# EasyEDA Pro project ProPrj_VEX_Competition_Switch_Duo_2025-08-30.epro

# Schematic VEX_Competition_Switch_Duo
Board Name: VEX_Competition_Switch_Duo; Create Date: 2025-08-25; Page Name: v1_SCH; Project Name: VEX_Competition_Switch_Duo; Schematic Name: VEX_Competition_Switch_Duo; Update Date: 2025-08-25; Add into BOM: yes; Company: Your Company; Convert to PCB: yes; Date: 2025-08-22; Draw By: noozabooz; REV: 1.0; Sheet: 1/1; spicePre: .
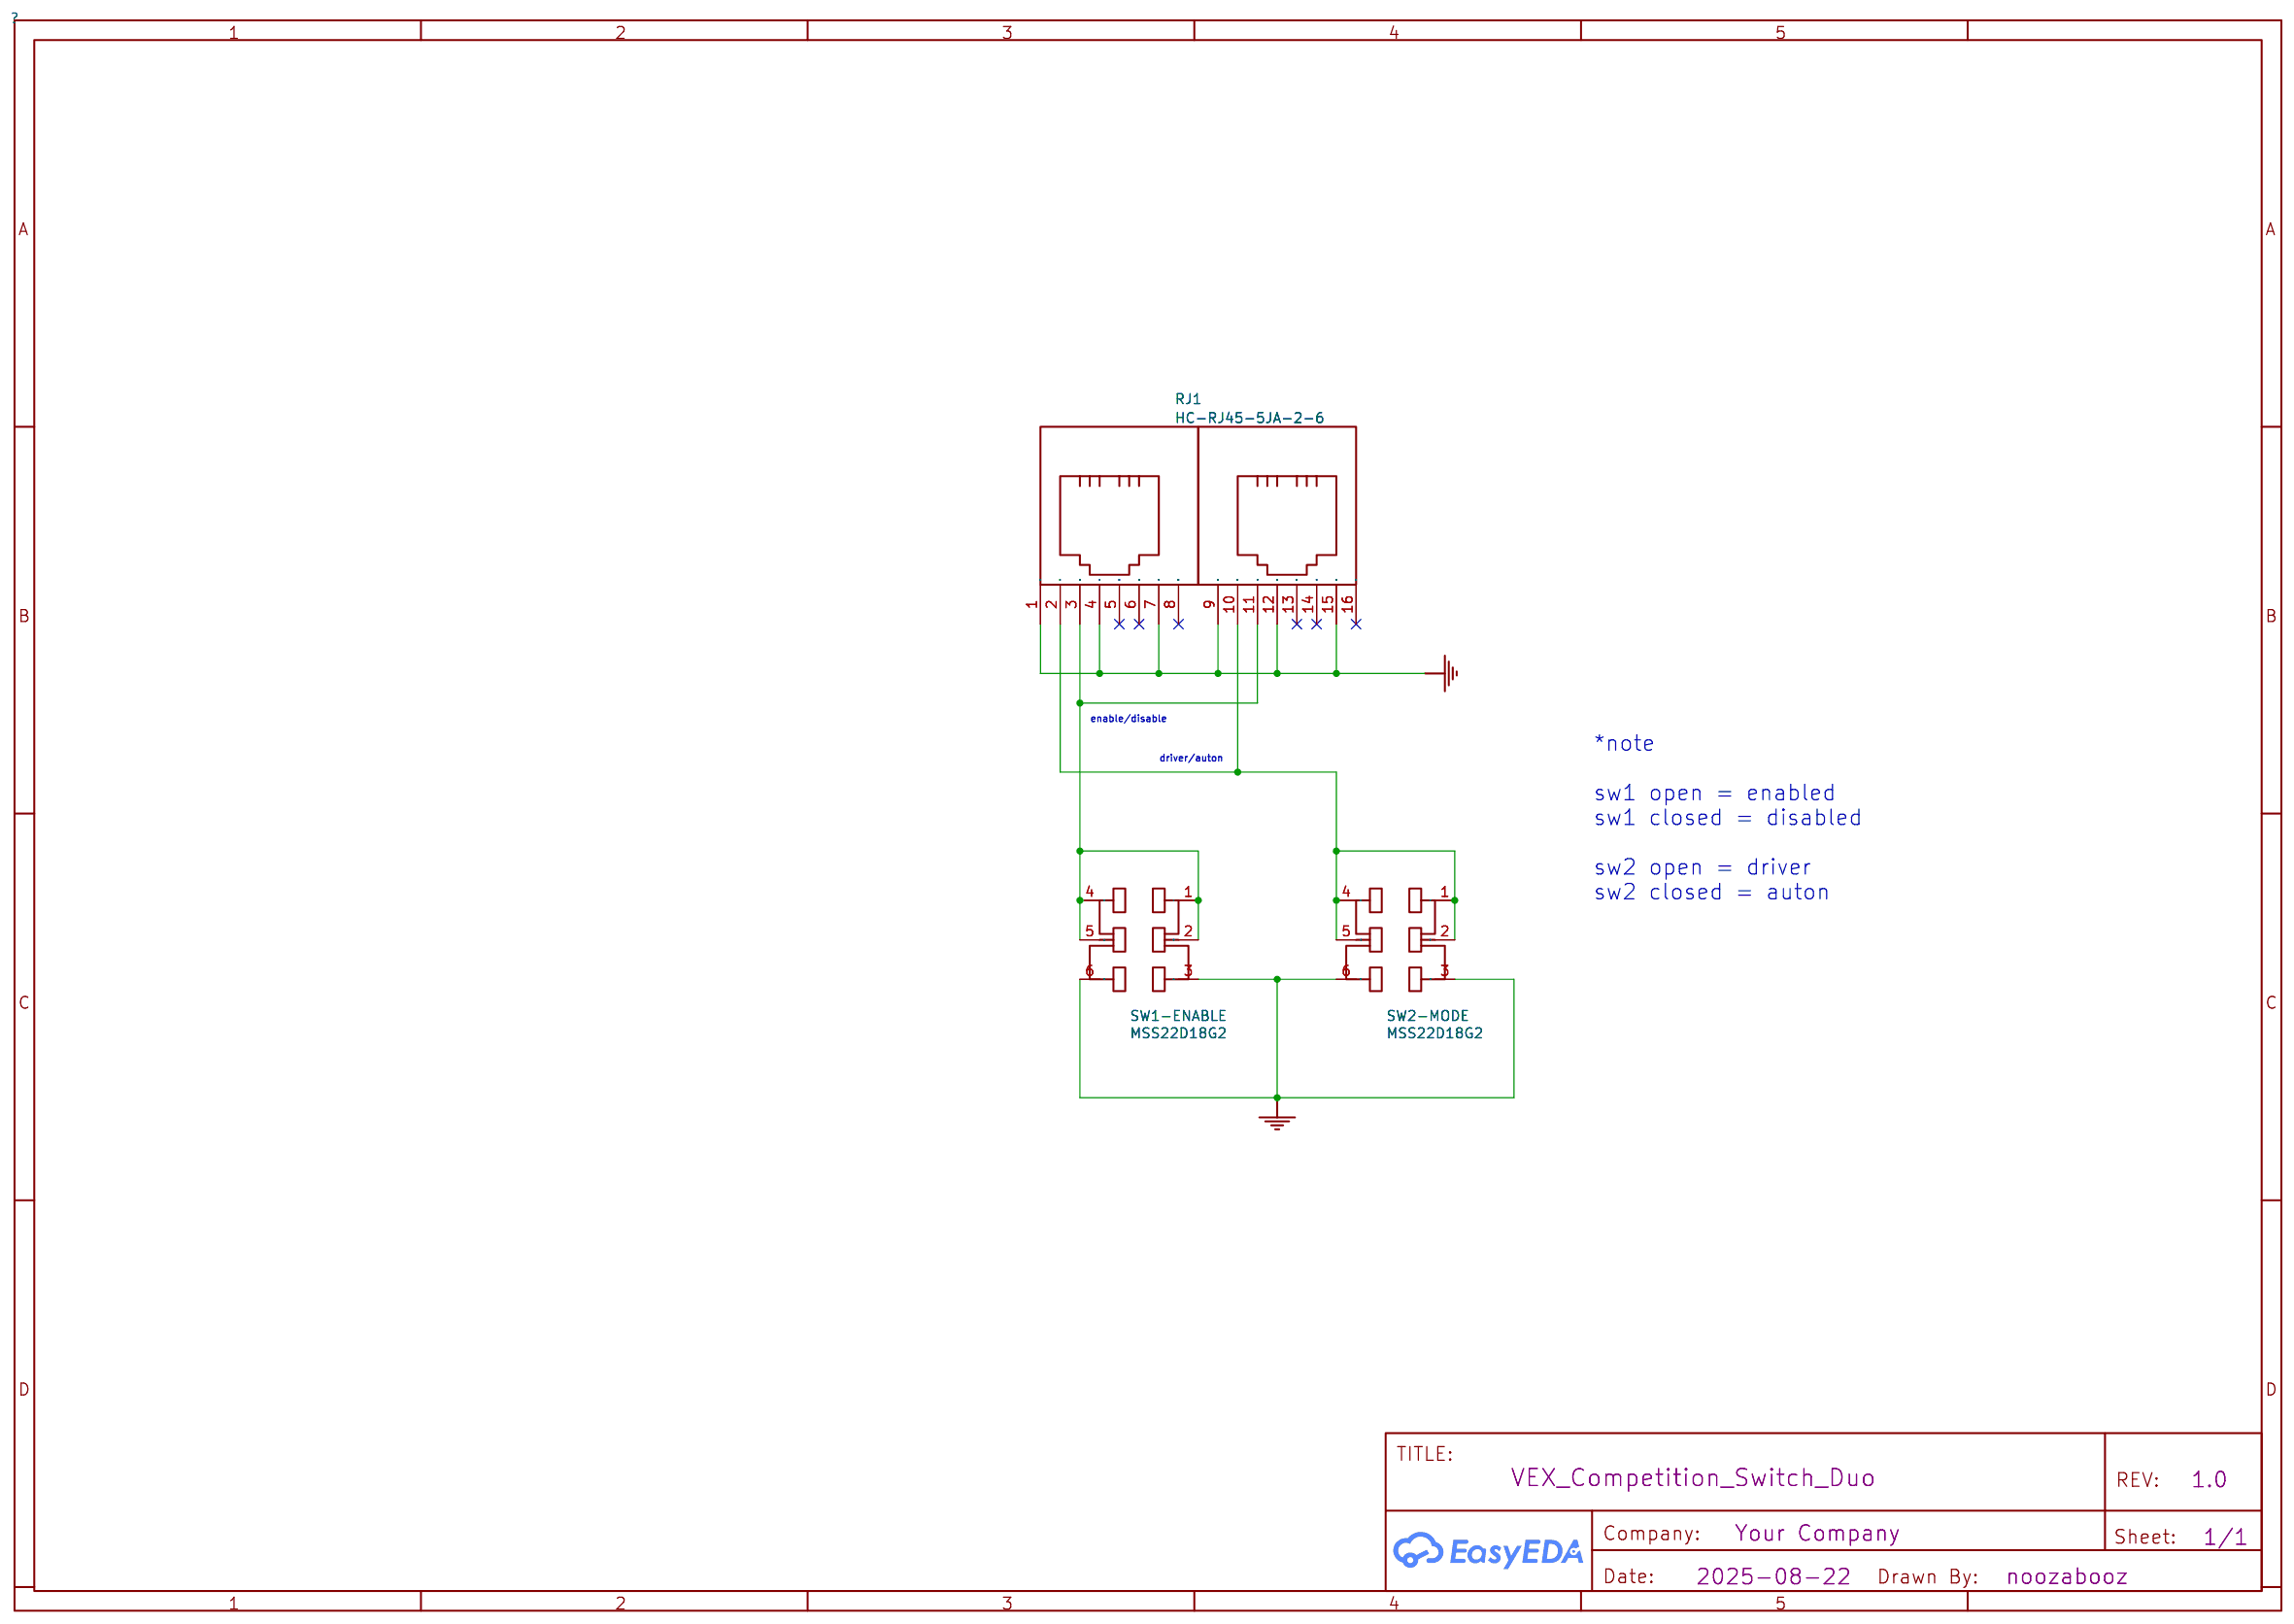
[diagram p0: schematic sheet]

## Parts
RJ1  HC-RJ45-5JA-2-6  [RJ45-TH_HC-RJ45-5JA-2-6-S]
SW1-ENABLE  MSS22D18G2  [SW-TH_MSS22D18GX]
SW2-MODE  MSS22D18G2  [SW-TH_MSS22D18GX]

## Library data of the parts
RJ1 = HC-RJ45-5JA-2-6: Supplier: LCSC; Supplier Part: C3000181; Manufacturer: HCTL(华灿天禄); Contributor: lcsc; spicePre: R
SW1-ENABLE SW2-MODE = MSS22D18G2: Supplier: LCSC; Supplier Part: C431542; Manufacturer: SHOU HAN(首韩); JLCPCB Part Class: Extended Part; Contributor: LCSC; spicePre: S

## Nets
GND: RJ1.1 RJ1.4 RJ1.7 RJ1.9 RJ1.12 RJ1.15 SW1-ENABLE.3 SW1-ENABLE.6 SW2-MODE.3 SW2-MODE.6
RJ1_2: RJ1.2 RJ1.10 SW2-MODE.1 SW2-MODE.2 SW2-MODE.4 SW2-MODE.5
RJ1_3: RJ1.3 RJ1.11 SW1-ENABLE.1 SW1-ENABLE.2 SW1-ENABLE.4 SW1-ENABLE.5

Not connected (* = marked no-connect by the designer): RJ1 5* 6* 8* 13* 14* 16*

## Notes on the sheet
- enable/disable
- *note
  sw1 open = enabled
  sw1 closed = disabled
  sw2 open = driver
  sw2 closed = auton
- driver/auton

# Board v1.0_PCB
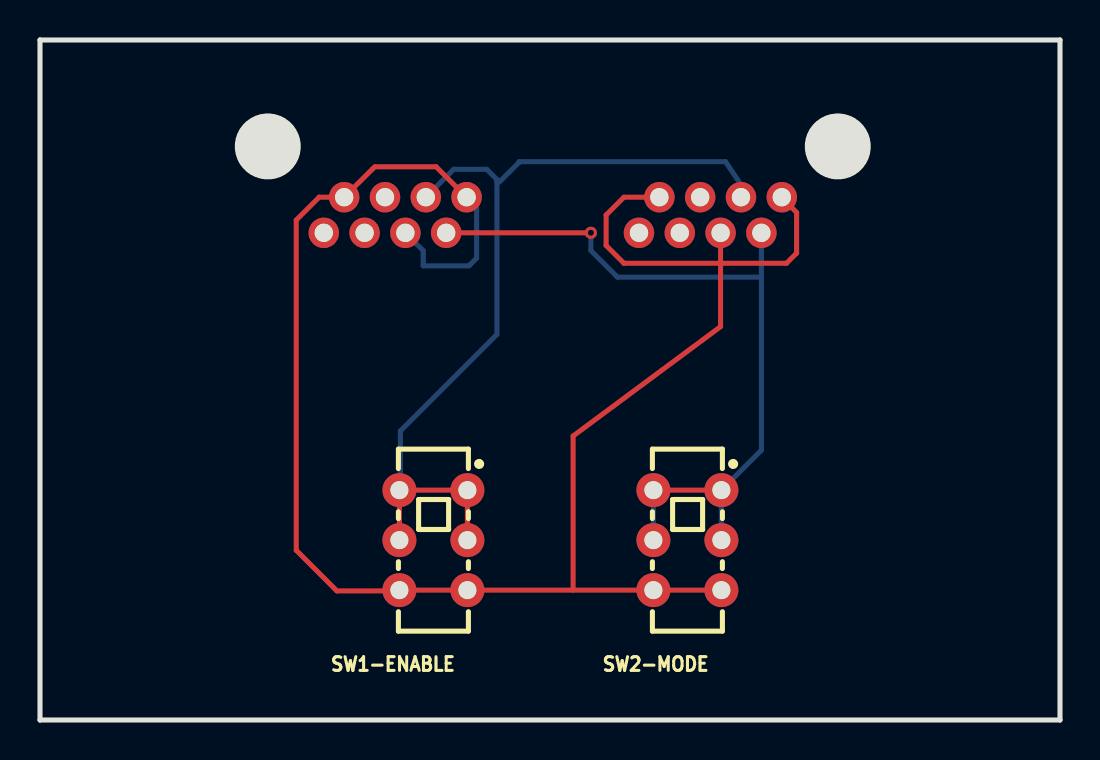
[diagram p1: board, top side]
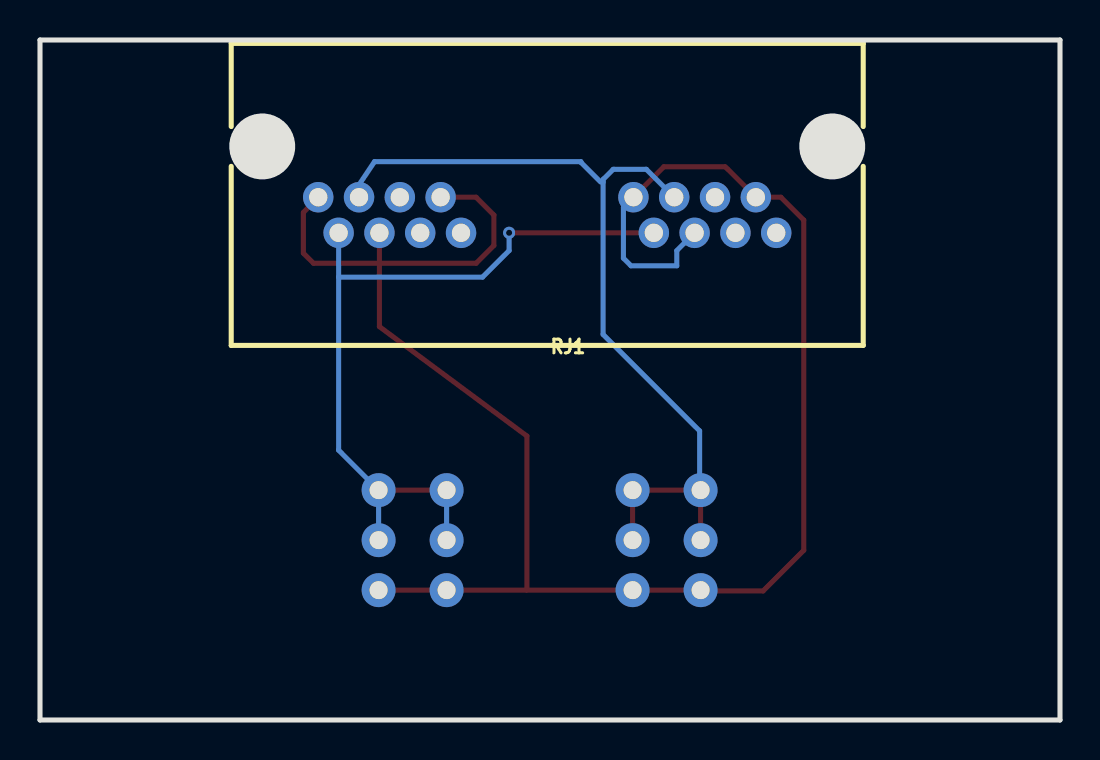
[diagram p2: board, bottom side, seen from below]

Outline 51 x 34 mm; copper layers: Top Layer, Bottom Layer. Coordinates in mm from the lower left corner of the outline.
Outline path: 0,34 51,34 51,0 0,0 0,34

## Design rules (mm)
via Default (default): diameter min 0.61, default 0.61, max 100.025; hole min 0.305, default 0.305, max 59.995

## Placement (name value [footprint] x y rotation side)
RJ1  HC-RJ45-5JA-2-6  [RJ45-TH_HC-RJ45-5JA-2-6-S]  25.64 25.25 0 bottom
SW1-ENABLE  MSS22D18G2  [SW-TH_MSS22D18GX]  19.67 8.99 270 top
SW2-MODE  MSS22D18G2  [SW-TH_MSS22D18GX]  32.37 8.99 270 top

## Footprints (pads in the part's own frame, mm; a bottom-side part is the same pattern mirrored in y, then rotated)
RJ45-TH_HC-RJ45-5JA-2-6-S
  round 1.524 hole 0.914: 1(11.45,-0.89) 2(10.43,0.89) 3(9.41,-0.89) 4(8.39,0.89) 5(7.37,-0.89) 6(6.35,0.89) 7(5.33,-0.89) 8(4.31,0.89) 9(-4.31,-0.89) 10(-5.33,0.89) 11(-6.35,-0.89) 12(-7.37,0.89) 13(-8.39,-0.89) 14(-9.41,0.89) 15(-10.43,-0.89) 16(-11.45,0.89)
SW-TH_MSS22D18GX
  round 1.7 hole 0.9: 1(-2.5,1.7) 2(0,1.7) 3(2.5,1.7) 4(-2.5,-1.7) 5(0,-1.7) 6(2.5,-1.7)

## Nets
As in the schematic.

Pads without a net: RJ1 5 6 8 13 14 16

## Via types
v1: diameter 0.61, hole 0.305, Top Layer to Bottom Layer, 1 via

## Routing (per net, layer and track width the routed paths; a pad name or vN(x,y) marks a point on that pad's centre or on a via; arc(x,y) is an arc through that point)
GND: length 96.3
  Top Layer w0.254: RJ1.4 34.03,19.67 26.66,14.2 26.66,6.49 ; RJ1.9 19.81,27.66 16.75,27.66 16.62,27.55 RJ1.15 13.96,26.14 12.81,25 12.81,8.48 14.84,6.45 17.93,6.45 SW1-ENABLE.6 SW1-ENABLE.3 SW2-MODE.6 SW2-MODE.3 ; 37.09,26.14 37.83,25.38 37.83,23.34 37.32,22.84 29.19,22.84 28.31,23.72 28.31,25.25 29.2,26.14 30.97,26.14
  Bottom Layer w0.254: RJ1.12 19.16,23.47 19.16,22.71 21.45,22.71 21.83,23.09 21.83,25.64 21.33,26.14
RJ1_2: length 39.3
  Top Layer w0.254: v1(27.54,24.36) 20.31,24.36 ; SW2-MODE.4 SW2-MODE.1
  Bottom Layer w0.254: 36.07,24.36 36.07,13.49 SW2-MODE.1 SW2-MODE.2 ; 36.07,22.14 28.87,22.14 27.54,23.47 v1(27.54,24.36) ; SW2-MODE.5 SW2-MODE.4
RJ1_3: length 44.1
  Top Layer w0.254: SW1-ENABLE.5 SW1-ENABLE.4 SW1-ENABLE.1 SW1-ENABLE.2
  Bottom Layer w0.254: SW1-ENABLE.4 18.02,11.54 18.02,14.45 22.84,19.28 22.84,27.03 22.34,27.53 20.69,27.53 19.29,26.14 ; 35.05,26.14 35.05,26.76 34.28,27.92 23.96,27.92 23.96,27.89 22.97,26.9

# Board v1.1_PCB
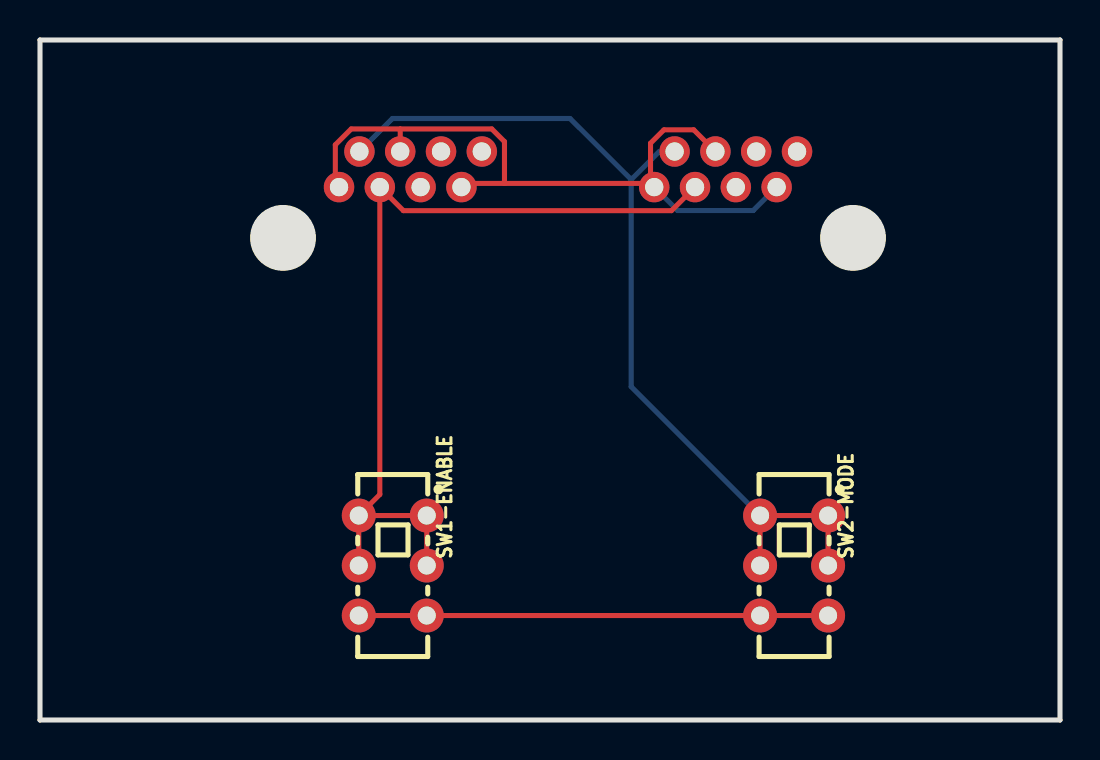
[diagram p3: board, top side]
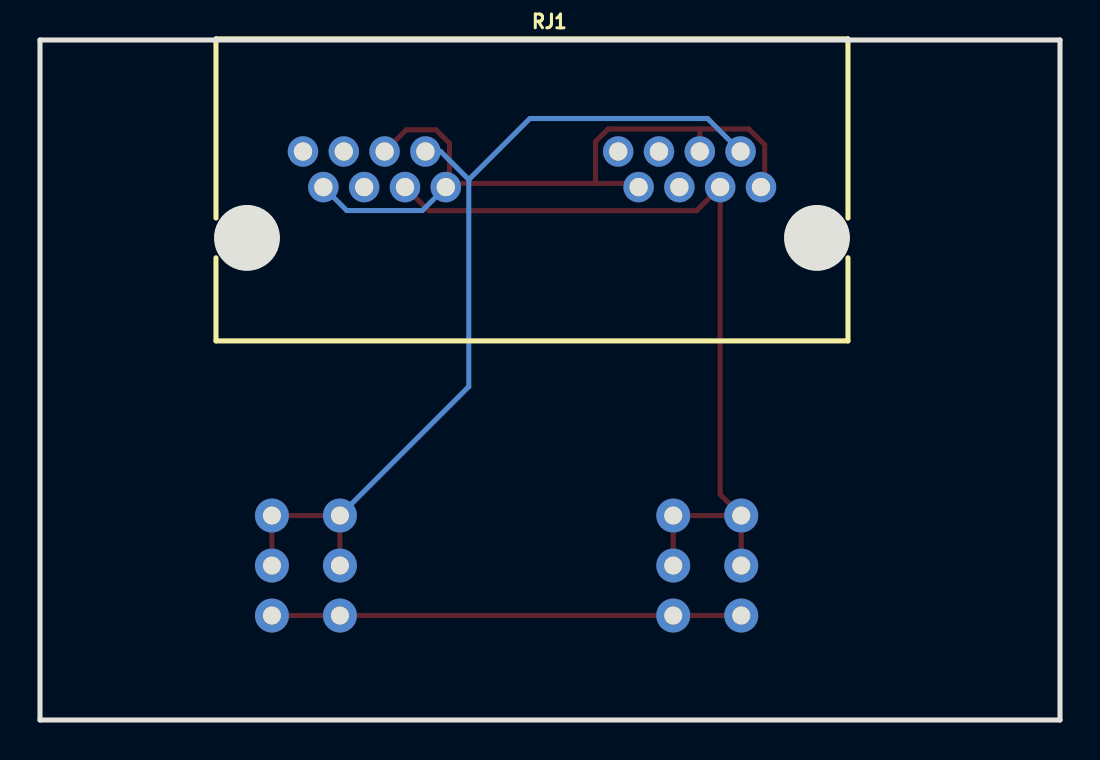
[diagram p4: board, bottom side, seen from below]

Outline 51 x 34 mm; copper layers: Top Layer, Bottom Layer. Coordinates in mm from the lower left corner of the outline.
Outline path: 0,34 51,34 51,0 0,0 0,34
Stack: Top Layer 0.035mm / Dielectric1 1.51mm FR4 er 4.5 / Bottom Layer 0.035mm

## Design rules (mm)
spacing Default (default): track to track 0.152, other pairs 0 to 0.152
track width Default (default): min 0.254, default 0.254, max 25.4
differential pair differentialPair (default): width min 0.127, default 0.254, max 2.54; gap min 0.152, default 0.152
via Default (default): diameter min 0.61, default 0.61, max 100.025; hole min 0.305, default 0.305, max 59.995

## Placement (name value [footprint] x y rotation side)
RJ1  HC-RJ45-5JA-2-6  [RJ45-TH_HC-RJ45-5JA-2-6-S]  26.4 27.53 180 bottom
SW1-ENABLE  MSS22D18G2  [SW-TH_MSS22D18GX]  17.64 7.72 270 top
SW2-MODE  MSS22D18G2  [SW-TH_MSS22D18GX]  37.7 7.72 270 top

## Footprints (pads in the part's own frame, mm; a bottom-side part is the same pattern mirrored in y, then rotated)
RJ45-TH_HC-RJ45-5JA-2-6-S
  round 1.524 hole 0.914: 1(11.45,-0.89) 2(10.43,0.89) 3(9.41,-0.89) 4(8.39,0.89) 5(7.37,-0.89) 6(6.35,0.89) 7(5.33,-0.89) 8(4.31,0.89) 9(-4.31,-0.89) 10(-5.33,0.89) 11(-6.35,-0.89) 12(-7.37,0.89) 13(-8.39,-0.89) 14(-9.41,0.89) 15(-10.43,-0.89) 16(-11.45,0.89)
SW-TH_MSS22D18GX
  round 1.7 hole 0.9: 1(-2.5,1.7) 2(0,1.7) 3(2.5,1.7) 4(-2.5,-1.7) 5(0,-1.7) 6(2.5,-1.7)

## Nets
GND: RJ1.1 RJ1.4 RJ1.7 RJ1.9 RJ1.12 RJ1.15 SW1-ENABLE.3 SW1-ENABLE.6 SW2-MODE.3 SW2-MODE.6
RJ1_2: RJ1.2 RJ1.10 SW2-MODE.1 SW2-MODE.2 SW2-MODE.4 SW2-MODE.5
RJ1_3: RJ1.3 RJ1.11 SW1-ENABLE.1 SW1-ENABLE.2 SW1-ENABLE.4 SW1-ENABLE.5

Pads without a net: RJ1 5 6 8 13 14 16

## Routing (per net, layer and track width the routed paths; a pad name or vN(x,y) marks a point on that pad's centre or on a via; arc(x,y) is an arc through that point)
GND: length 60.8
  Top Layer w0.254: 30.53,26.83 RJ1.9 ; 30.53,26.83 30.53,28.84 31.2,29.51 32.69,29.51 RJ1.12 ; 30.53,26.83 23.22,26.83 ; 23.22,26.83 23.22,28.92 22.59,29.55 18.01,29.55 ; 23.22,26.83 21.25,26.83 RJ1.7 ; SW1-ENABLE.6 SW1-ENABLE.3 SW2-MODE.6 SW2-MODE.3 ; 18.01,29.55 RJ1.4 ; 18.01,29.55 15.56,29.55 14.77,28.76 14.77,26.83 RJ1.1
  Bottom Layer w0.254: RJ1.9 31.88,25.47 35.66,25.47 RJ1.15
RJ1_2: length 46.2
  Top Layer w0.254: SW2-MODE.5 SW2-MODE.4 SW2-MODE.1 39.4,7.72
  Bottom Layer w0.254: RJ1.2 17.62,30.08 26.5,30.08 29.56,27.02 ; SW2-MODE.4 29.56,16.67 29.56,27.02 30.97,28.42 RJ1.10
RJ1_3: length 42
  Top Layer w0.254: SW1-ENABLE.4 16.99,11.28 RJ1.3 18.17,25.47 31.57,25.47 RJ1.11 ; SW1-ENABLE.4 SW1-ENABLE.1 19.34,7.72 ; SW1-ENABLE.4 SW1-ENABLE.5

# Board v1.2_PCB
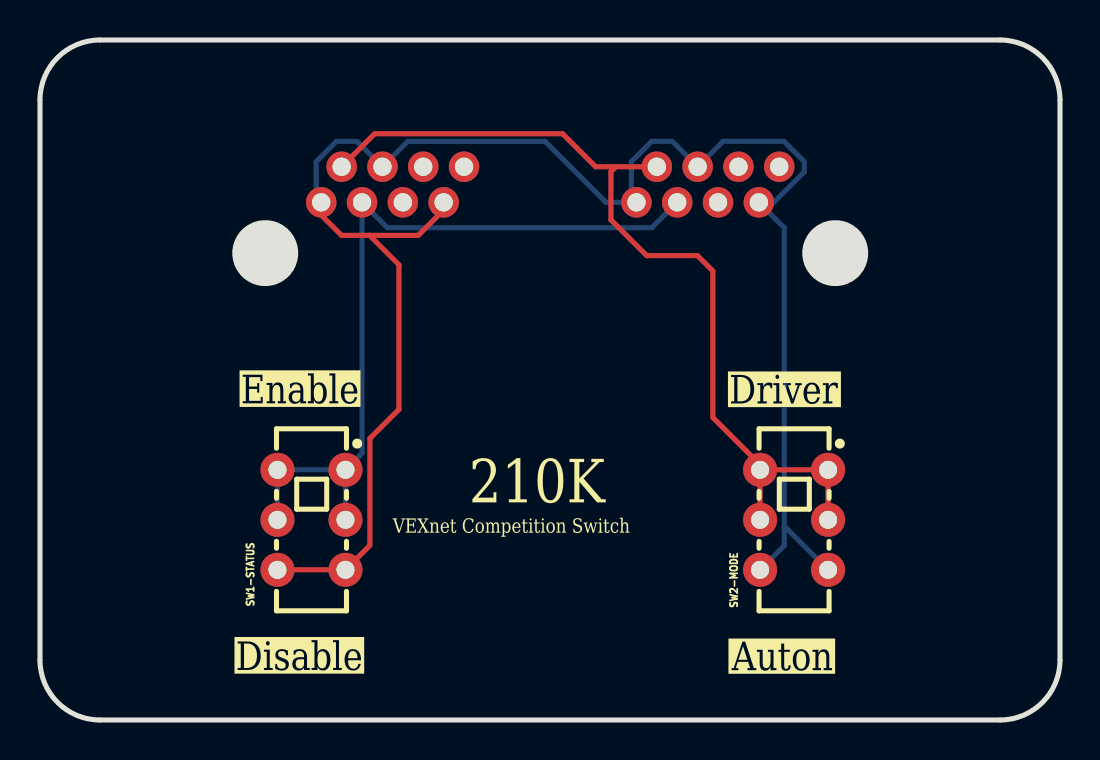
[diagram p5: board, top side]
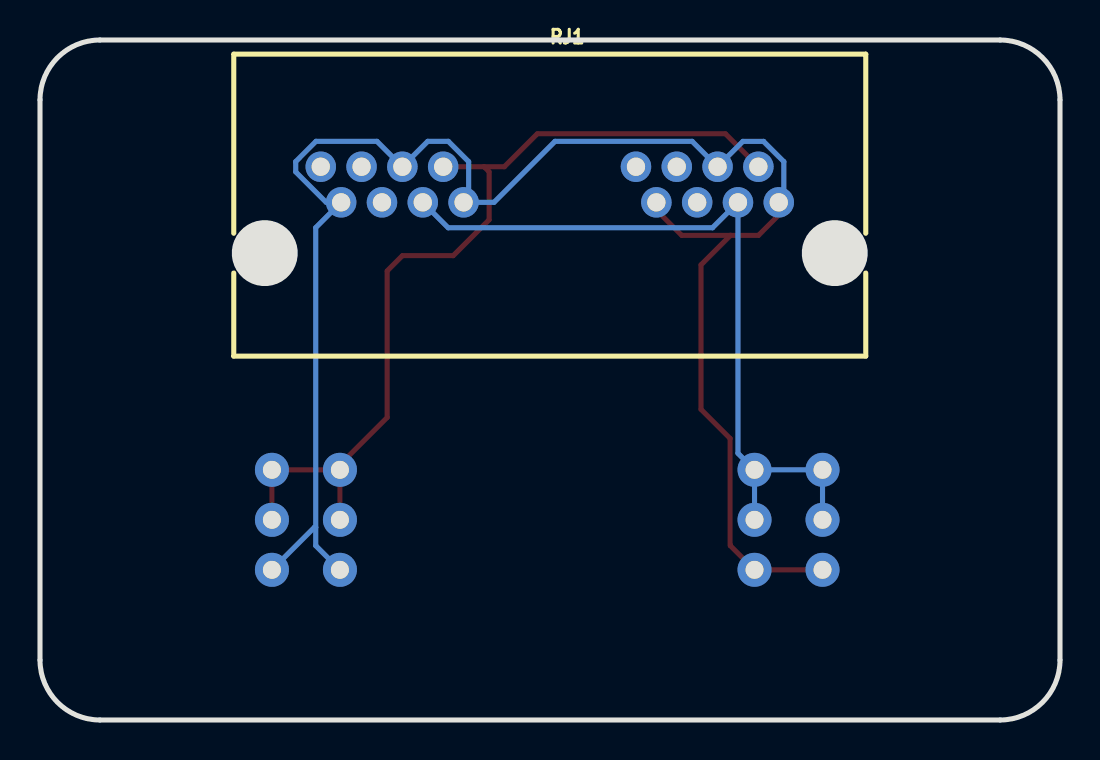
[diagram p6: board, bottom side, seen from below]

Outline 51 x 34 mm; copper layers: Top Layer, Bottom Layer. Coordinates in mm from the lower left corner of the outline.
Outline path: 0,31 arc(0.88,33.12) 3,34 48,34 arc(50.12,33.12) 51,31 51,3 arc(50.12,0.88) 48,0 3,0 arc(0.88,0.88) 0,3 0,31
Stack: Top Layer 0.035mm / Dielectric1 1.51mm FR4 er 4.5 / Bottom Layer 0.035mm

## Design rules (mm)
spacing Default (default): track to track 0.152, other pairs 0 to 0.152
track width Default (default): min 0.254, default 0.254, max 25.4
differential pair differentialPair (default): width min 0.127, default 0.254, max 2.54; gap min 0.152, default 0.152
via Default (default): diameter min 0.61, default 0.61, max 100.025; hole min 0.305, default 0.305, max 59.995

## Placement (name value [footprint] x y rotation side)
RJ1  HC-RJ45-5JA-2-6  [RJ45-TH_HC-RJ45-5JA-2-6-S]  25.51 26.77 180 bottom
SW1-STATUS  MSS22D18G2  [SW-TH_MSS22D18GX]  13.57 10.01 270 top
SW2-MODE  MSS22D18G2  [SW-TH_MSS22D18GX]  37.7 10.01 270 top

## Footprints (pads in the part's own frame, mm; a bottom-side part is the same pattern mirrored in y, then rotated)
RJ45-TH_HC-RJ45-5JA-2-6-S
  round 1.524 hole 0.914: 1(11.45,-0.89) 2(10.43,0.89) 3(9.41,-0.89) 4(8.39,0.89) 5(7.37,-0.89) 6(6.35,0.89) 7(5.33,-0.89) 8(4.31,0.89) 9(-4.31,-0.89) 10(-5.33,0.89) 11(-6.35,-0.89) 12(-7.37,0.89) 13(-8.39,-0.89) 14(-9.41,0.89) 15(-10.43,-0.89) 16(-11.45,0.89)
SW-TH_MSS22D18GX
  round 1.7 hole 0.9: 1(-2.5,1.7) 2(0,1.7) 3(2.5,1.7) 4(-2.5,-1.7) 5(0,-1.7) 6(2.5,-1.7)

## Nets
GND: RJ1.1 RJ1.4 RJ1.7 RJ1.9 RJ1.12 RJ1.15 SW1-STATUS.3 SW1-STATUS.6 SW2-MODE.3 SW2-MODE.6
RJ1_2: RJ1.2 RJ1.10 SW2-MODE.1 SW2-MODE.2 SW2-MODE.4 SW2-MODE.5
RJ1_3: RJ1.3 RJ1.11 SW1-STATUS.1 SW1-STATUS.2 SW1-STATUS.4 SW1-STATUS.5

Pads without a net: RJ1 5 6 8 13 14 16

## Routing (per net, layer and track width the routed paths; a pad name or vN(x,y) marks a point on that pad's centre or on a via; arc(x,y) is an arc through that point)
GND: length 89.3
  Top Layer w0.254: SW1-STATUS.6 SW1-STATUS.3 16.47,8.71 16.47,8.74 ; 16.47,24.23 15.08,24.23 14.06,25.25 RJ1.1 ; 16.47,24.23 17.95,22.76 17.95,15.53 16.5,14.08 16.5,8.74 ; 16.47,24.23 18.91,24.23 20.18,25.5 RJ1.7
  Bottom Layer w0.254: 37.21,9.63 37.21,24.61 35.94,25.88 ; 37.21,9.63 37.28,9.63 SW2-MODE.3 ; 37.21,9.63 37.21,8.72 SW2-MODE.6 ; 35.94,25.88 36.69,25.88 38.22,27.41 38.22,27.92 37.2,28.93 34.15,28.93 RJ1.12 31.61,28.93 30.58,28.93 29.57,27.92 29.57,25.88 ; 35.94,25.88 RJ1.15 ; RJ1.9 28.3,25.88 25.25,28.93 18.39,28.93 RJ1.4 15.85,28.93 14.82,28.93 13.81,27.91 13.81,26.14 RJ1.1
RJ1_2: length 45.1
  Top Layer w0.254: 36,12.76 33.64,15.13 33.64,22.45 32.88,23.22 30.34,23.22 28.54,25.01 28.54,27.41 28.8,27.66 ; 28.8,27.66 RJ1.10 ; 28.8,27.66 27.78,27.66 26.13,29.31 16.73,29.31 RJ1.2 ; SW2-MODE.2 SW2-MODE.1 SW2-MODE.4 SW2-MODE.5
RJ1_3: length 38.9
  Bottom Layer w0.254: SW1-STATUS.1 SW1-STATUS.4 SW1-STATUS.5 ; SW1-STATUS.1 16.1,13.34 RJ1.3 17.37,24.61 30.59,24.61 RJ1.11 ; SW1-STATUS.1 SW1-STATUS.2

## Text on the board
Top Solder Mask Layer: @NoozAbooz | Made with ❤️ in Canada
Top Silkscreen Layer: VEXnet Competition Switch | 210K | Disable | Enable | Driver | Auton
